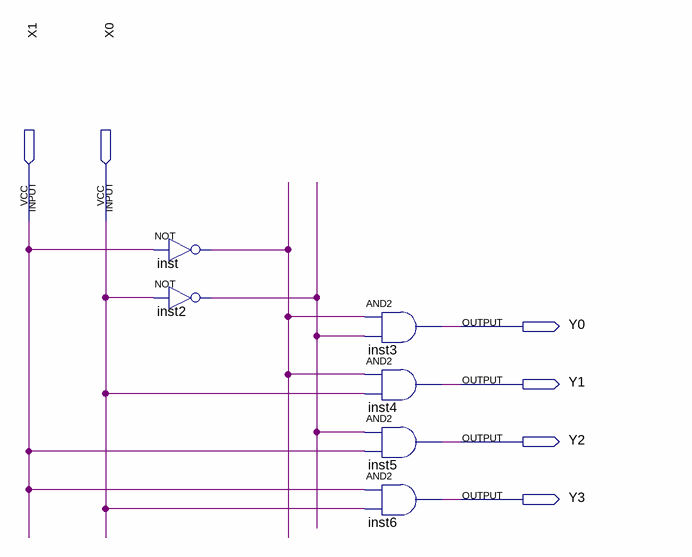
[diagram p0: schematic sheet]
// Quartus schematic 31.bdf as structural Verilog: 6 symbols, 6 pins
module \31  (
  input  X1,
  input  X0,
  output Y0,
  output Y1,
  output Y2,
  output Y3
);

  wire inst2_out, inst_out;

  not inst (inst_out, X1);
  not inst2 (inst2_out, X0);
  and inst3 (Y0, inst_out, inst2_out);
  and inst4 (Y1, inst_out, X0);
  and inst5 (Y2, inst2_out, X1);
  and inst6 (Y3, X1, X0);
endmodule
